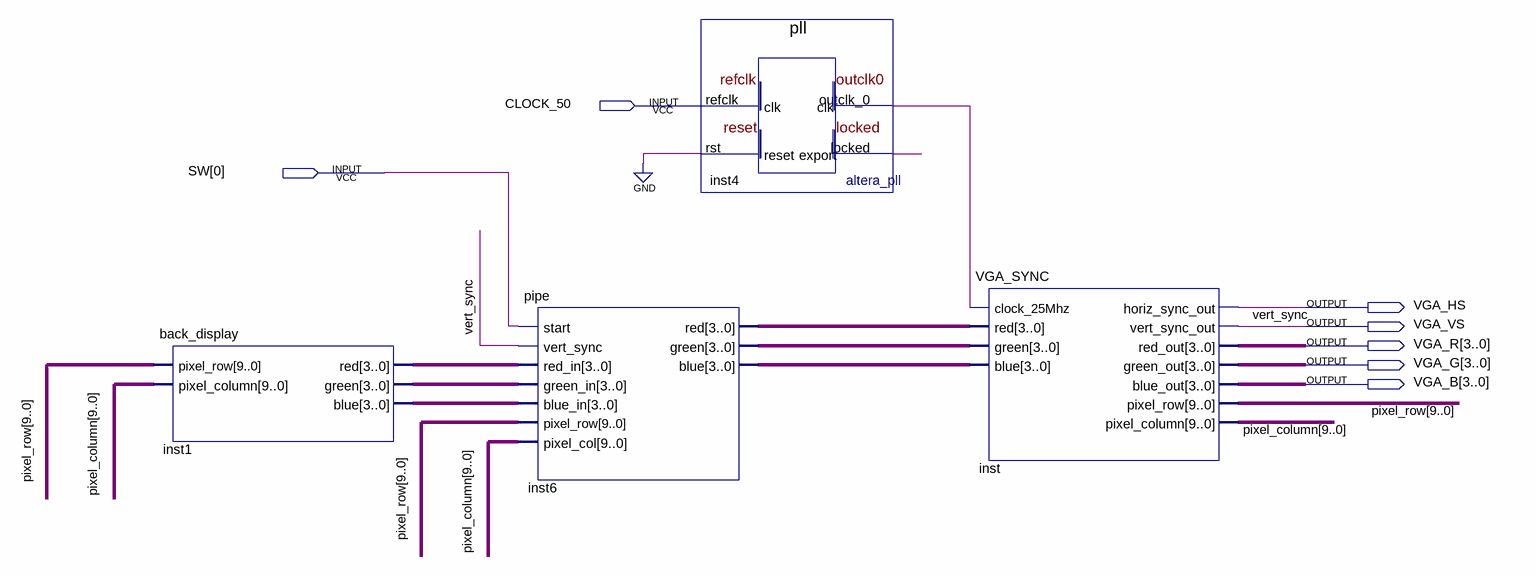
[diagram p0: schematic sheet]
// Quartus schematic pipe_test.bdf as structural Verilog: 4 symbols, 7 pins
module pipe_test (
  input  CLOCK_50,
  input  [0:0] SW,
  output VGA_HS,
  output VGA_VS,
  output [3:0] VGA_R,
  output [3:0] VGA_G,
  output [3:0] VGA_B
);

  wire inst4_locked, inst4_outclk_0;
  wire [3:0] inst1_blue, inst1_green, inst1_red, inst6_blue, inst6_green, inst6_red;
  wire [9:0] pixel_column, pixel_row;

  back_display inst1 (
    .pixel_row(pixel_row), .pixel_column(pixel_column), .red(inst1_red), .green(inst1_green),
    .blue(inst1_blue));
  pipe inst6 (
    .start(SW[0]), .vert_sync(VGA_VS), .red_in(inst1_red), .green_in(inst1_green), .blue_in(inst1_blue),
    .pixel_row(pixel_row), .pixel_col(pixel_column), .red(inst6_red), .green(inst6_green), .blue(inst6_blue));
  pll inst4 (.refclk(CLOCK_50), .rst(1'b0), .outclk_0(inst4_outclk_0), .locked(inst4_locked));
  VGA_SYNC inst (
    .clock_25Mhz(inst4_outclk_0), .red(inst6_red), .green(inst6_green), .blue(inst6_blue),
    .horiz_sync_out(VGA_HS), .vert_sync_out(VGA_VS), .red_out(VGA_R), .green_out(VGA_G), .blue_out(VGA_B),
    .pixel_row(pixel_row), .pixel_column(pixel_column));

  // Other names for the same wires on the sheet: vert_sync = VGA_VS
endmodule
